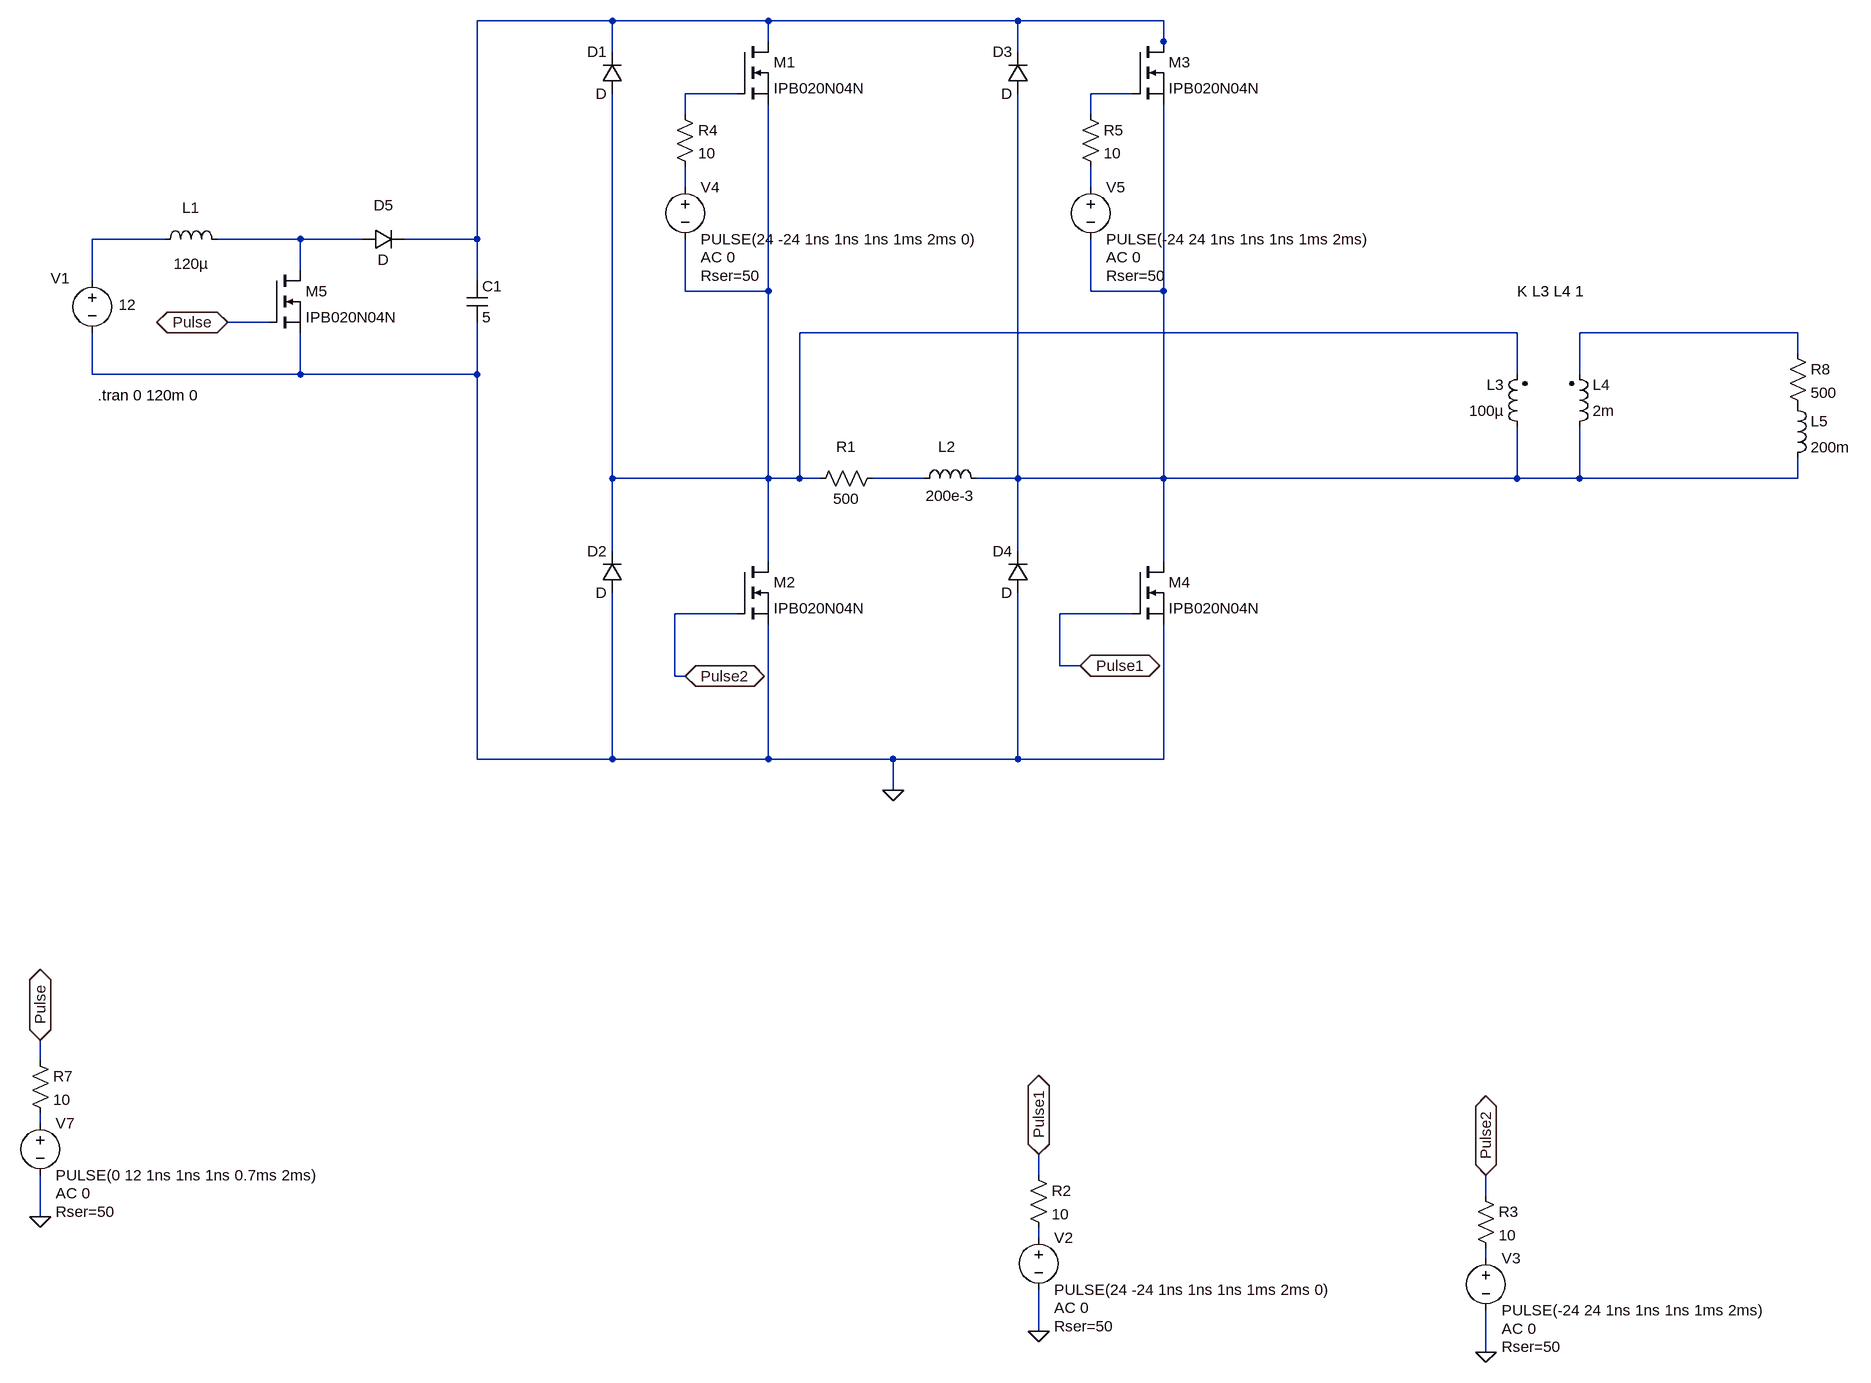
[diagram p0: schematic schémacomplet.asc]
schémacomplet.asc, the LTspice schematic file:
Version 4
SHEET 1 2272 1608
WIRE -1424 -480 -1632 -480
WIRE -1184 -480 -1424 -480
WIRE -800 -480 -1184 -480
WIRE -576 -480 -800 -480
WIRE -1184 -448 -1184 -480
WIRE -576 -448 -576 -480
WIRE -1424 -432 -1424 -480
WIRE -800 -432 -800 -480
WIRE -576 -432 -576 -448
WIRE -1232 -368 -1312 -368
WIRE -624 -368 -688 -368
WIRE -1312 -336 -1312 -368
WIRE -688 -336 -688 -368
WIRE -1312 -224 -1312 -256
WIRE -688 -224 -688 -256
WIRE -2112 -144 -2224 -144
WIRE -1904 -144 -2032 -144
WIRE -1808 -144 -1904 -144
WIRE -1632 -144 -1632 -480
WIRE -1632 -144 -1744 -144
WIRE -1904 -96 -1904 -144
WIRE -2224 -80 -2224 -144
WIRE -1632 -80 -1632 -144
WIRE -1312 -64 -1312 -144
WIRE -1184 -64 -1184 -352
WIRE -1184 -64 -1312 -64
WIRE -688 -64 -688 -144
WIRE -576 -64 -576 -352
WIRE -576 -64 -688 -64
WIRE -1952 -16 -2016 -16
WIRE -32 0 -1136 0
WIRE 400 0 64 0
WIRE 400 32 400 0
WIRE -2224 64 -2224 0
WIRE -1904 64 -1904 0
WIRE -1904 64 -2224 64
WIRE -1632 64 -1632 -16
WIRE -1632 64 -1904 64
WIRE -32 64 -32 0
WIRE 64 64 64 0
WIRE -1424 224 -1424 -368
WIRE -1184 224 -1184 -64
WIRE -1184 224 -1424 224
WIRE -1136 224 -1136 0
WIRE -1136 224 -1184 224
WIRE -1104 224 -1136 224
WIRE -944 224 -1024 224
WIRE -800 224 -800 -368
WIRE -800 224 -864 224
WIRE -576 224 -576 -64
WIRE -576 224 -800 224
WIRE -32 224 -32 144
WIRE -32 224 -576 224
WIRE 64 224 64 144
WIRE 64 224 -32 224
WIRE 400 224 400 192
WIRE 400 224 64 224
WIRE -1424 336 -1424 224
WIRE -800 336 -800 224
WIRE -1184 352 -1184 224
WIRE -576 352 -576 224
WIRE -1232 432 -1328 432
WIRE -624 432 -736 432
WIRE -736 512 -736 432
WIRE -704 512 -736 512
WIRE -1328 528 -1328 432
WIRE -1312 528 -1328 528
WIRE -1632 656 -1632 64
WIRE -1424 656 -1424 400
WIRE -1424 656 -1632 656
WIRE -1184 656 -1184 448
WIRE -1184 656 -1424 656
WIRE -992 656 -1184 656
WIRE -800 656 -800 400
WIRE -800 656 -992 656
WIRE -576 656 -576 448
WIRE -576 656 -800 656
WIRE -992 704 -992 656
WIRE -2304 1120 -2304 1088
WIRE -2304 1216 -2304 1200
WIRE -768 1296 -768 1264
WIRE -80 1328 -80 1296
WIRE -2304 1360 -2304 1296
WIRE -768 1392 -768 1376
WIRE -80 1424 -80 1408
WIRE -768 1536 -768 1472
WIRE -80 1568 -80 1504
FLAG -768 1264 Pulse1
IOPIN -768 1264 BiDir
FLAG -768 1536 0
FLAG -80 1296 Pulse2
IOPIN -80 1296 BiDir
FLAG -80 1568 0
FLAG -1312 528 Pulse2
IOPIN -1312 528 BiDir
FLAG -704 512 Pulse1
IOPIN -704 512 BiDir
FLAG -2304 1088 Pulse
IOPIN -2304 1088 BiDir
FLAG -2304 1360 0
FLAG -992 704 0
FLAG -2016 -16 Pulse
IOPIN -2016 -16 BiDir
SYMBOL diode -1408 -368 R180
WINDOW 0 24 64 Left 2
WINDOW 3 24 0 Left 2
SYMATTR InstName D1
SYMBOL diode -1408 400 R180
WINDOW 0 24 64 Left 2
WINDOW 3 24 0 Left 2
SYMATTR InstName D2
SYMBOL diode -784 -368 R180
WINDOW 0 24 64 Left 2
WINDOW 3 24 0 Left 2
SYMATTR InstName D3
SYMBOL diode -784 400 R180
WINDOW 0 24 64 Left 2
WINDOW 3 24 0 Left 2
SYMATTR InstName D4
SYMBOL res -1008 208 R90
WINDOW 0 -17 56 VBottom 2
WINDOW 3 32 56 VTop 2
SYMATTR InstName R1
SYMATTR Value 500
SYMBOL ind -848 240 M270
WINDOW 0 49 61 VTop 2
WINDOW 3 5 56 VBottom 2
SYMATTR InstName L2
SYMATTR Value 200e-3
SYMBOL voltage -768 1376 R0
WINDOW 123 24 124 Left 2
WINDOW 39 24 152 Left 2
SYMATTR Value2 AC 0
SYMATTR SpiceLine Rser=50
SYMATTR InstName V2
SYMATTR Value PULSE(24 -24 1ns 1ns 1ns 1ms 2ms 0)
SYMBOL res -784 1280 R0
SYMATTR InstName R2
SYMATTR Value 10
SYMBOL voltage -80 1408 R0
WINDOW 123 24 124 Left 2
WINDOW 39 24 152 Left 2
SYMATTR Value2 AC 0
SYMATTR SpiceLine Rser=50
SYMATTR InstName V3
SYMATTR Value PULSE(-24 24 1ns 1ns 1ns 1ms 2ms)
SYMBOL res -96 1312 R0
SYMATTR InstName R3
SYMATTR Value 10
SYMBOL nmos -1232 -448 R0
SYMATTR InstName M1
SYMATTR Value IPB020N04N
SYMBOL nmos -1232 352 R0
SYMATTR InstName M2
SYMATTR Value IPB020N04N
SYMBOL nmos -624 -448 R0
SYMATTR InstName M3
SYMATTR Value IPB020N04N
SYMBOL nmos -624 352 R0
SYMATTR InstName M4
SYMATTR Value IPB020N04N
SYMBOL voltage -1312 -240 R0
WINDOW 123 24 124 Left 2
WINDOW 39 24 152 Left 2
SYMATTR Value2 AC 0
SYMATTR SpiceLine Rser=50
SYMATTR InstName V4
SYMATTR Value PULSE(24 -24 1ns 1ns 1ns 1ms 2ms 0)
SYMBOL res -1328 -352 R0
SYMATTR InstName R4
SYMATTR Value 10
SYMBOL voltage -688 -240 R0
WINDOW 123 24 124 Left 2
WINDOW 39 24 152 Left 2
SYMATTR Value2 AC 0
SYMATTR SpiceLine Rser=50
SYMATTR InstName V5
SYMATTR Value PULSE(-24 24 1ns 1ns 1ns 1ms 2ms)
SYMBOL res -704 -352 R0
SYMATTR InstName R5
SYMATTR Value 10
SYMBOL voltage -2304 1200 R0
WINDOW 123 24 124 Left 2
WINDOW 39 24 152 Left 2
SYMATTR Value2 AC 0
SYMATTR SpiceLine Rser=50
SYMATTR InstName V7
SYMATTR Value PULSE(0 12 1ns 1ns 1ns 0.7ms 2ms)
SYMBOL res -2320 1104 R0
SYMATTR InstName R7
SYMATTR Value 10
SYMBOL ind2 -16 160 R180
WINDOW 0 36 80 Left 2
WINDOW 3 36 40 Left 2
SYMATTR InstName L3
SYMATTR Value 100µ
SYMBOL ind2 48 160 M180
WINDOW 0 36 80 Left 2
WINDOW 3 36 40 Left 2
SYMATTR InstName L4
SYMATTR Value 2m
SYMBOL res 384 16 R0
SYMATTR InstName R8
SYMATTR Value 500
SYMBOL ind 384 96 R0
SYMATTR InstName L5
SYMATTR Value 200m
SYMBOL ind -2128 -128 R270
WINDOW 0 49 56 VTop 2
WINDOW 3 -6 56 VBottom 2
SYMATTR InstName L1
SYMATTR Value 120µ
SYMBOL diode -1808 -128 R270
WINDOW 0 53 32 VTop 2
WINDOW 3 0 32 VBottom 2
SYMATTR InstName D5
SYMBOL cap -1648 -80 R0
SYMATTR InstName C1
SYMATTR Value 5
SYMBOL voltage -2224 -96 R0
WINDOW 0 -64 12 Left 2
WINDOW 3 41 53 Left 2
WINDOW 123 0 0 Left 2
WINDOW 39 -130 67 Left 2
SYMATTR InstName V1
SYMATTR Value 12
SYMBOL nmos -1952 -96 R0
SYMATTR InstName M5
SYMATTR Value IPB020N04N
TEXT -32 -64 Left 2 !K L3 L4 1
TEXT -2216 96 Left 2 !.tran 0 120m 0

The netlist it stands for:
* schémacomplet.asc
D1 N008 N001 D
D2 0 N008 D
D3 N009 N001 D
D4 0 N009 D
R1 N011 N008 500
L2 N009 N011 200e-3
V2 N013 0 PULSE(24 -24 1ns 1ns 1ns 1ms 2ms 0) AC 0 Rser=50
R2 Pulse1 N013 10
V3 N014 0 PULSE(-24 24 1ns 1ns 1ns 1ms 2ms) AC 0 Rser=50
R3 Pulse2 N014 10
M1 N001 N002 N008 N008 IPB020N04N
M2 N008 Pulse2 0 0 IPB020N04N
M3 N001 N003 N009 N009 IPB020N04N
M4 N009 Pulse1 0 0 IPB020N04N
V4 N004 N008 PULSE(24 -24 1ns 1ns 1ns 1ms 2ms 0) AC 0 Rser=50
R4 N002 N004 10
V5 N005 N009 PULSE(-24 24 1ns 1ns 1ns 1ms 2ms) AC 0 Rser=50
R5 N003 N005 10
V7 N012 0 PULSE(0 12 1ns 1ns 1ns 0.7ms 2ms) AC 0 Rser=50
R7 Pulse N012 10
L3 N009 N008 100µ
L4 N009 N010 2m
R8 N010 P001 500
L5 P001 N009 200m
L1 N006 N007 120µ
D5 N007 N001 D
C1 N001 0 5
V1 N006 0 12
M5 N007 Pulse 0 0 IPB020N04N
.model D D
.lib standard.dio
.model NMOS NMOS
.model PMOS PMOS
.lib standard.mos
K L3 L4 1
.tran 0 120m 0
.backanno
.end